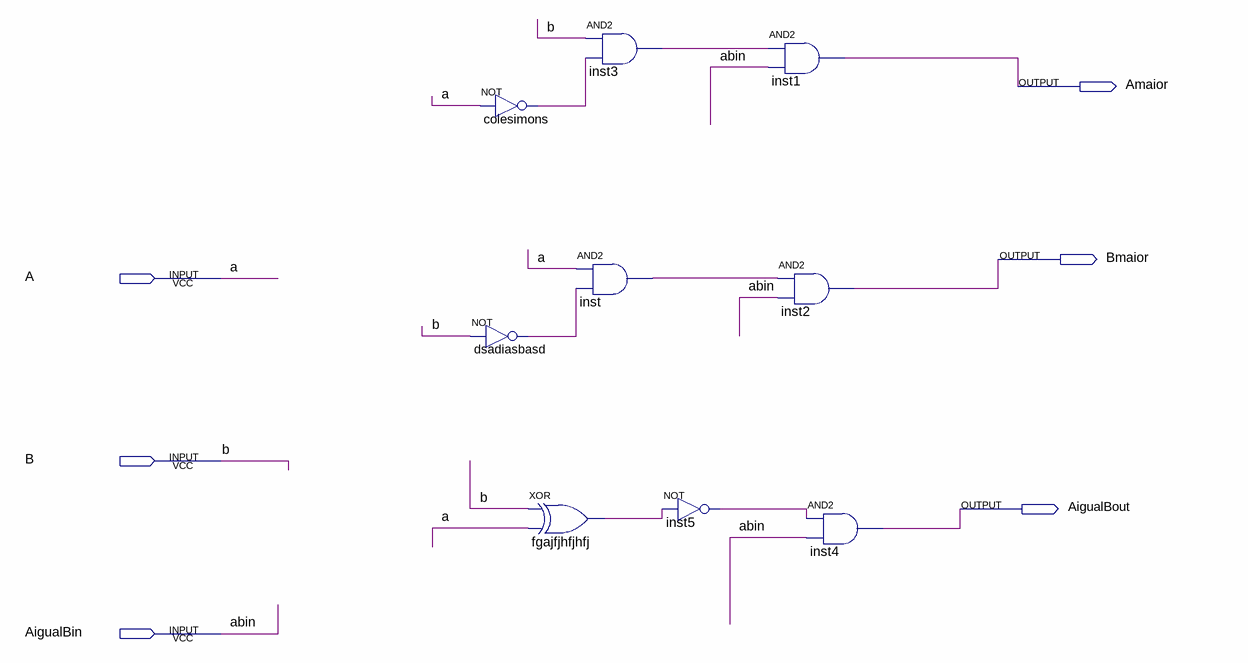
[diagram p0: schematic sheet]
// Quartus schematic unidcomparador.bdf as structural Verilog: 9 symbols, 6 pins
module unidcomparador (
  input  A,
  input  B,
  input  AigualBin,
  output Amaior,
  output Bmaior,
  output AigualBout
);

  wire colesimons_out, dsadiasbasd_out, fgajfjhfjhfj_out, inst3_out, inst5_out, inst_out;

  not colesimons (colesimons_out, A);
  not dsadiasbasd (dsadiasbasd_out, B);
  and inst3 (inst3_out, B, colesimons_out);
  and inst (inst_out, A, dsadiasbasd_out);
  xor fgajfjhfjhfj (fgajfjhfjhfj_out, B, A);
  not inst5 (inst5_out, fgajfjhfjhfj_out);
  and inst1 (Amaior, inst3_out, AigualBin);
  and inst2 (Bmaior, inst_out, AigualBin);
  and inst4 (AigualBout, inst5_out, AigualBin);

  // Other names for the same wires on the sheet: abin = AigualBin
endmodule
